# EAGLE design SC_UnoNeoClock V1.2 (EAGLE 8.7.0)
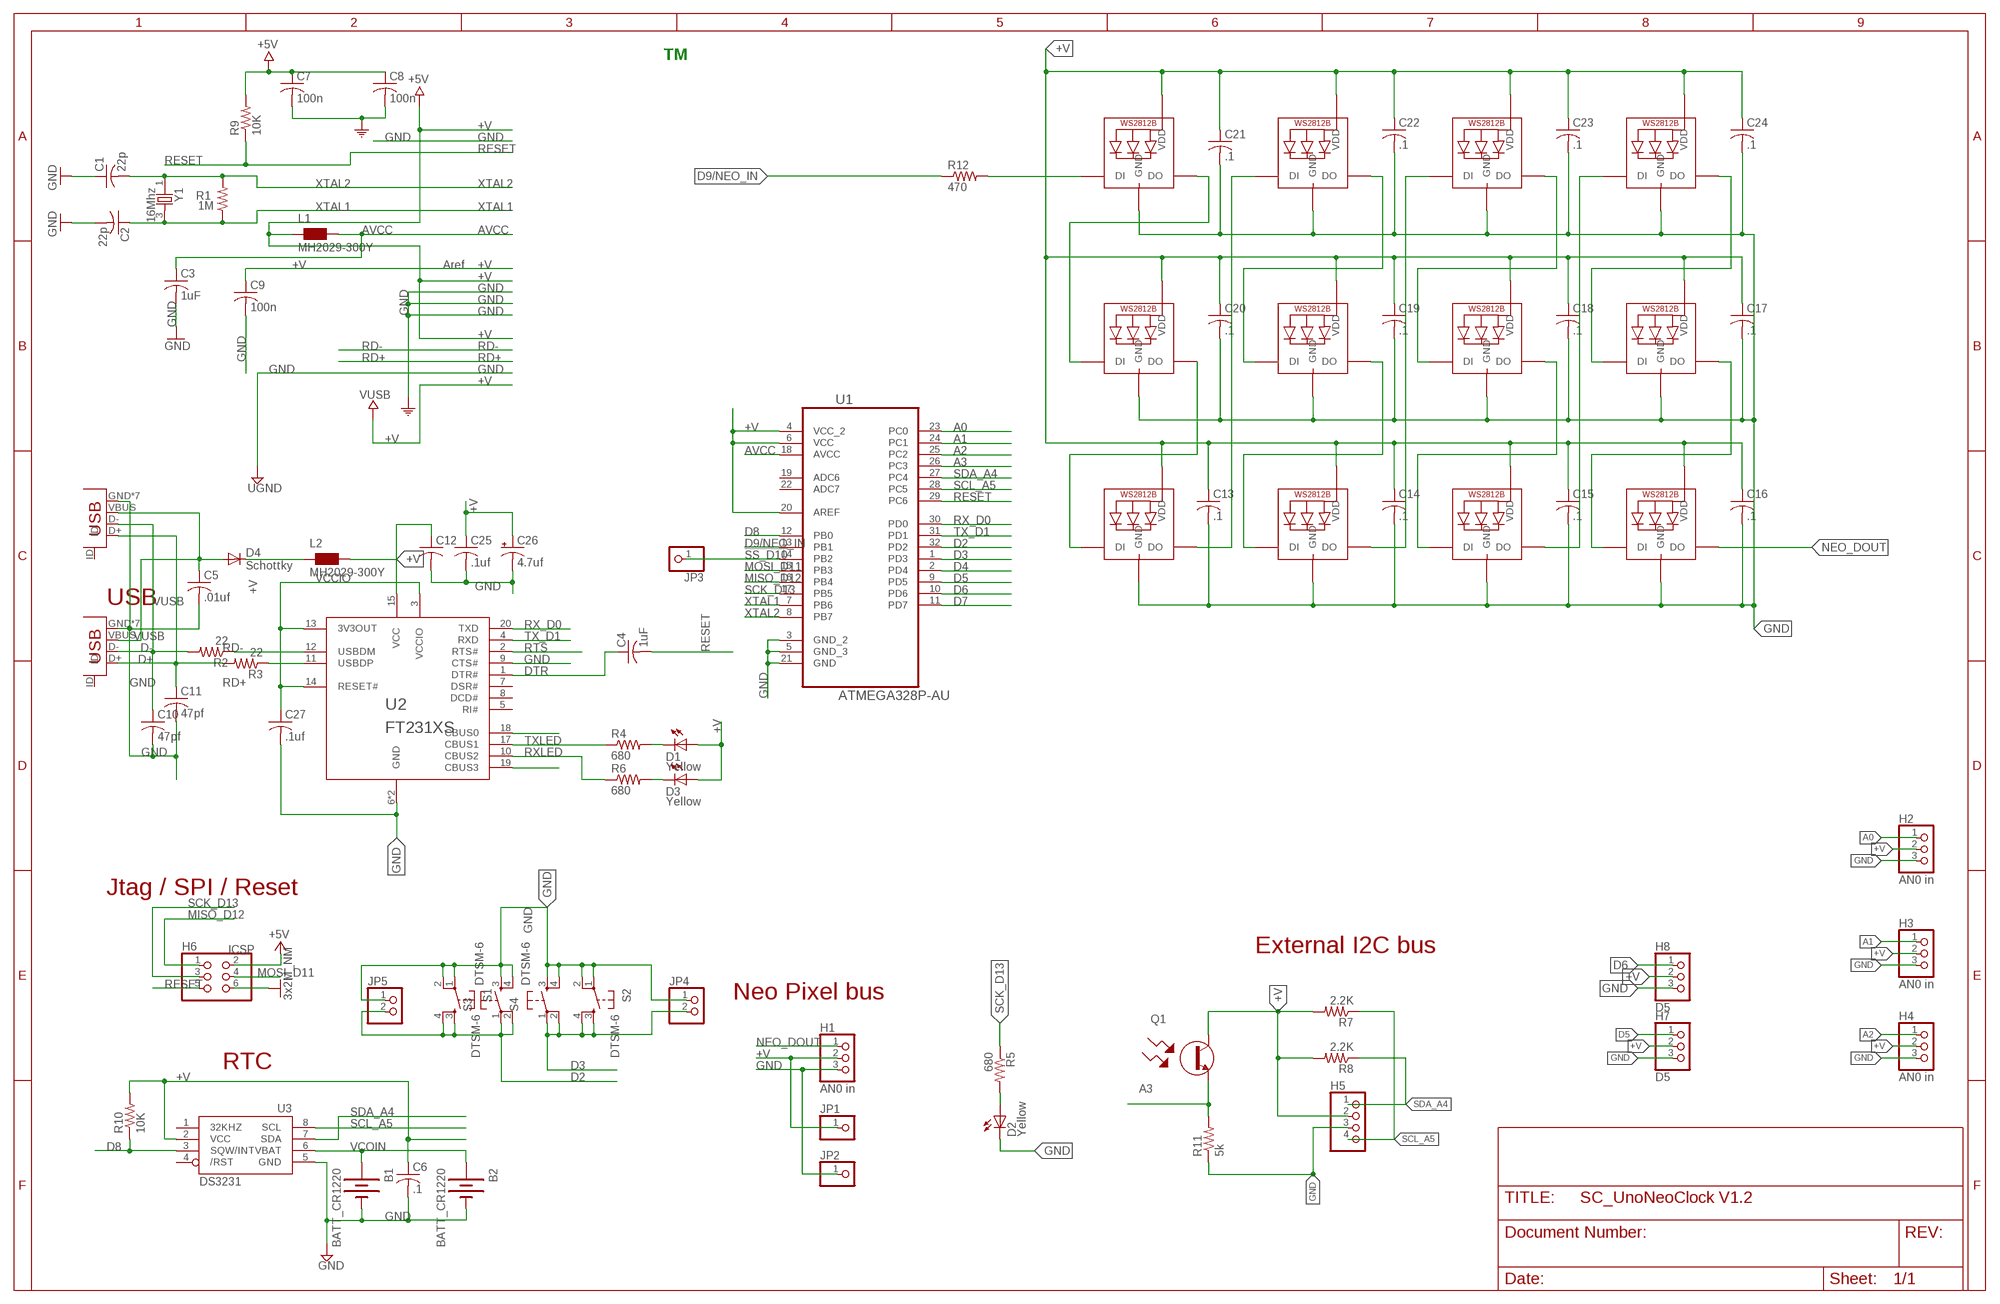
[diagram p0: schematic, sheet 1]

## Parts
B1  BATT_CR1220  [BATT_CR1220_HOLDER_SMT]
B2  BATT_CR1220  [BATT_CR1220_HOLDER_SMT]
C1  22p  C-USC0805K  [C0805K]
C2  22p  C-USC0805K  [C0805K]
C3  1uF  C-USC0805K  [C0805K]
C4  1uF  C-USC0805K  [C0805K]
C5  .01uf  C-USC0805K  [C0805K]
C6  .1  C-USC0805K  [C0805K]
C7  100n  C-USC0805K  [C0805K]
C8  100n  C-USC0805K  [C0805K]
C9  100n  C-USC0805K  [C0805K]
C10  47pf  C-USC0805K  [C0805K]
C11  47pf  C-USC0805K  [C0805K]
C12  C-USC1206K  [C1206K]
C13  .1  C-USC0805K  [C0805K]
C14  .1  C-USC0805K  [C0805K]
C15  .1  C-USC0805K  [C0805K]
C16  .1  C-USC0805K  [C0805K]
C17  .1  C-USC0805K  [C0805K]
C18  .1  C-USC0805K  [C0805K]
C19  .1  C-USC0805K  [C0805K]
C20  .1  C-USC0805K  [C0805K]
C21  .1  C-USC0805K  [C0805K]
C22  .1  C-USC0805K  [C0805K]
C23  .1  C-USC0805K  [C0805K]
C24  .1  C-USC0805K  [C0805K]
C25  .1uf  C-USC0805K  [C0805K]
C26  4.7uf  CPOL-USSMCP  [SMC_P]
C27  .1uf  C-USC0805K  [C0805K]
D1  Yellow  LEDCHIP-LED0805  [CHIP-LED0805]
D2  Yellow  LEDCHIP-LED0805  [CHIP-LED0805]
D3  Yellow  LEDCHIP-LED0805  [CHIP-LED0805]
D4  Schottky  DIODE-SOD123  [SOD123]
H1  AN0 in  PINHD-1X03_2.54-S  [1X03-S]
H2  AN0 in  PINHD-1X03_2.54-S  [1X03-S]
H3  AN0 in  PINHD-1X03_2.54-S  [1X03-S]
H4  AN0 in  PINHD-1X03_2.54-S  [1X03-S]
H5  PINHD-1X04_2.54-S  [1X04-S]
H6  ICSP  PINHD-2X3  [2X03]
H7  D5  PINHD-1X03_2.54-S  [1X03-S]
H8  D5  PINHD-1X03_2.54-S  [1X03-S]
J1  USB-MICRO-B-SMT/TH  [USB-MICRO-B-SMT]
J2  USB-MICRO-B-SMT/TH  [USB-MICRO-B-SMT]
JP1  PINHD-1X1  [1X01]
JP2  PINHD-1X1  [1X01]
JP3  PINHD-1X1  [1X01]
JP4  PINHD-1X02_2.54-S  [1X02-S]
JP5  PINHD-1X02_2.54-S  [1X02-S]
L1  MH2029-300Y  WE-CBF_0805  [0805]
L2  MH2029-300Y  WE-CBF_0805  [0805]
LED1  WS2812B5050  [WS2812B]
LED2  WS2812B5050  [WS2812B]
LED3  WS2812B5050  [WS2812B]
LED4  WS2812B5050  [WS2812B]
LED5  WS2812B5050  [WS2812B]
LED6  WS2812B5050  [WS2812B]
LED7  WS2812B5050  [WS2812B]
LED8  WS2812B5050  [WS2812B]
LED9  WS2812B5050  [WS2812B]
LED10  WS2812B5050  [WS2812B]
LED11  WS2812B5050  [WS2812B]
LED12  WS2812B5050  [WS2812B]
Q1  KDT00030FSTR  [PT0603]
R1  1M  R-US_R0805  [R0805]
R2  22  R-US_R0805  [R0805]
R3  22  R-US_R0805  [R0805]
R4  680  R-US_R0805  [R0805]
R5  680  R-US_R0805  [R0805]
R6  680  R-US_R0805  [R0805]
R7  2.2K  R-US_R0805  [R0805]
R8  2.2K  R-US_R0805  [R0805]
R9  10K  R-US_R0805  [R0805]
R10  10K  R-US_R0805  [R0805]
R11  5k  R-US_R0805  [R0805]
R12  470  R-US_R0805  [R0805]
S1  DTSM-6  [DTSM-6]
S2  DTSM-6  [DTSM-6]
S3  DTSM-6  [DTSM-6]
S4  DTSM-6  [DTSM-6]
U1  ATMEGA328P-AU  [QFP80P900X900X120-32N]
U2  FT231XS  [SSOP20]
U3  DS3231  [SOIC8]
Y1  16Mhz  XTAL3X5MM  [3X5XTAL-SMT]

## Nets
!SS_D10: JP3.1 U1.14(PB2)
+V [usbvcc]: C6.1 C7.1 C8.1 C9.1 C12.1 C13.1 C14.1 C15.1 C16.1 C17.1 C18.1 C19.1 C20.1 C21.1 C22.1 C23.1 C24.1 C25.1 C26.+ D1.A D3.A H1.2 H2.2 H3.2 H4.2 H5.2 H6.2 H7.2 H8.2 JP1.1 L1.1 L2.2 LED1.1-VDD(VDD) LED2.1-VDD(VDD) LED3.1-VDD(VDD) LED4.1-VDD(VDD) LED5.1-VDD(VDD) LED6.1-VDD(VDD) LED7.1-VDD(VDD) LED8.1-VDD(VDD) LED9.1-VDD(VDD) LED10.1-VDD(VDD) LED11.1-VDD(VDD) LED12.1-VDD(VDD) Q1.C R7.2 R8.2 R9.2 R10.2 U1.4(VCC_2) U1.6(VCC) U1.20(AREF) U2.15(VCC) U3.2(VCC) ; supply symbol labelled +5V, VUSB
A0: H2.1 U1.23(PC0)
A1: H3.1 U1.24(PC1)
A2: H4.1 U1.25(PC2)
A3: Q1.E R11.2 U1.26(PC3)
AVCC: C3.1 L1.2 U1.18(AVCC)
D2: JP5.2 S1.3 S1.4 S3.1 S3.2 U1.32(PD2)
D3: JP4.2 S2.3 S2.4 S4.1 S4.2 U1.1(PD3)
D4: U1.2(PD4)
D5: H7.1 U1.9(PD5)
D6: H8.1 U1.10(PD6)
D7: U1.11(PD7)
D8: R10.1 U1.12(PB0) U3.3(SQW/INT)
D9/NEO_IN: R12.1 U1.13(PB1)
D+: C11.1 J1.D+ J2.D+ R3.2
D-: C10.1 J1.D- J2.D- R2.2
DTR: C4.1 U2.1(DTR#)
GND [gnd]: B1.1(-) B2.1(-) C1.1 C2.2 C3.2 C5.2 C6.2 C7.2 C8.2 C9.2 C10.2 C11.2 C12.2 C13.2 C14.2 C15.2 C16.2 C17.2 C18.2 C19.2 C20.2 C21.2 C22.2 C23.2 C24.2 C25.2 C26.- C27.2 D2.C H1.3 H2.3 H3.3 H4.3 H5.3 H6.6 H7.3 H8.3 J1.GND J1.GND@1(GND) J1.GND@2(GND) J1.GND@3(GND) J1.GND@4(GND) J1.GND@5(GND) J1.GND@6(GND) J2.GND J2.GND@1(GND) J2.GND@2(GND) J2.GND@3(GND) J2.GND@4(GND) J2.GND@5(GND) J2.GND@6(GND) JP2.1 JP4.1 JP5.1 LED1.3-GND(GND) LED2.3-GND(GND) LED3.3-GND(GND) LED4.3-GND(GND) LED5.3-GND(GND) LED6.3-GND(GND) LED7.3-GND(GND) LED8.3-GND(GND) LED9.3-GND(GND) LED10.3-GND(GND) LED11.3-GND(GND) LED12.3-GND(GND) R11.1 S1.1 S1.2 S2.1 S2.2 S3.3 S3.4 S4.3 S4.4 U1.3(GND_2) U1.5(GND_3) U1.21(GND) U2.6(GND) U2.9(CTS#) U2.16(GND) U3.5(GND) ; supply symbol labelled 3x2M_NM, COM, UGND
MISO_D12: H6.1 U1.16(PB4)
MOSI_D11: H6.4 U1.15(PB3)
N$1: D2.A R5.2
N$2: D3.C R6.2
N$3: D1.C R4.2
N$4: LED1.2-DOUT(DO) LED2.4-DIN(DI)
N$5 [usbvcc]: D4.C L2.1
N$6: LED2.2-DOUT(DO) LED3.4-DIN(DI)
N$7: U2.18(CBUS0)
N$8: U2.19(CBUS3)
N$9: LED3.2-DOUT(DO) LED4.4-DIN(DI)
N$10: LED4.2-DOUT(DO) LED5.4-DIN(DI)
N$11: LED5.2-DOUT(DO) LED6.4-DIN(DI)
N$12: LED6.2-DOUT(DO) LED7.4-DIN(DI)
N$13: LED7.2-DOUT(DO) LED8.4-DIN(DI)
N$14: LED8.2-DOUT(DO) LED9.4-DIN(DI)
N$15: LED9.2-DOUT(DO) LED10.4-DIN(DI)
N$16: LED10.2-DOUT(DO) LED11.4-DIN(DI)
N$17: LED11.2-DOUT(DO) LED12.4-DIN(DI)
N$18: LED1.4-DIN(DI) R12.2
NEO_DOUT: H1.1 LED12.2-DOUT(DO)
RD+: R3.1 U2.11(USBDP)
RD-: R2.1 U2.12(USBDM)
RESET: C4.2 H6.5 R9.1 U1.29(PC6)
RTS: U2.2(RTS#)
RX_D0: U1.30(PD0) U2.20(TXD)
RXLED: R6.1 U2.10(CBUS2)
SCK_D13: H6.3 R5.1 U1.17(PB5)
SCL_A5: H5.4 R7.1 U1.28(PC5) U3.8(SCL)
SDA_A4: H5.1 R8.1 U1.27(PC4) U3.7(SDA)
TX_D1: U1.31(PD1) U2.4(RXD)
TXLED: R4.1 U2.17(CBUS1)
VCCIO: C27.1 U2.3(VCCIO) U2.13(3V3OUT) U2.14(RESET#)
VCOIN: B1.3(+) B2.3(+) U3.6(VBAT)
VUSB [usbvcc]: C5.1 D4.A J1.VBUS J2.VBUS
XTAL1: C2.1 R1.1 U1.7(PB6) Y1.3
XTAL2: C1.2 R1.2 U1.8(PB7) Y1.1
Unconnected: J1.ID J2.ID U1.19(ADC6) U1.22(ADC7) U2.5(RI#) U2.7(DSR#) U2.8(DCD#) U3.1(32KHZ) U3.4(/RST)

## Notes on the sheet
- TM
- Aref
- USB
- Jtag / SPI / Reset
- External I2C bus
- Neo Pixel bus
- RTC

## Library data of the parts
B1 B2 = dfb-parts:BATT_CR1220
C1-C25 C27 = rcl:C-US: CAPACITOR, American symbol
C26 = rcl:CPOL-US: POLARIZED CAPACITOR, American symbol
D1-D3 = Leoled:LED: LED OSRAM: - CHIPLED LG R971, LG N971, LY N971, LG Q971, LY Q971, LO R971, LY R971 LH N974, LH R974 LS Q976, LO Q976, LY Q976 LO Q996 - Hyper CHIPLED LW Q18S LB Q993, LB Q99A, LB R99A - SideLED LS A670, LO A670, LY A670, LG A670, LP A670 LB A673, LV A673, LT A673, LW A673 LH A674 LY A675 LS A676, LA A676, LO A676, LY A676, LW A676 LS A679, LY A679, LG A679 - Hyper Micro SIDELED® LS Y876, LA Y876, LO Y876, LY Y876 LT Y87S - SmartLED LW L88C, LW L88S LB L89C, LB L89S, LG L890 LS L89K, LO L89K, LY L89K LS L896, LA L896, LO L896, LY L896 - TOPLED LS T670, LO T670, LY T670, LG T670, LP T670 LSG T670, LSP T670, LSY T670, LOP T670, LYG T670 LG T671, LOG T671, LSG T671 LB T673, LV T673, LT T673, LW T673 LH T674 LS T676, LA T676, LO T676, LY T676, LB T676, LH T676, LSB T676, LW T676 LB T67C, LV T67C, LT T67C, LS T67K, LO T67K, LY T67K, LW E67C LS E67B, LA E67B, LO E67B, LY E67B, LB E67C, LV E67C, LT E67C LW T67C LS T679, LY T679, LG T679 LS T770, LO T770, LY T770, LG T770, LP T770 LB T773, LV T773, LT T773, LW T773 LH T774 LS E675, LA E675, LY E675, LS T675 LS T776, LA T776, LO T776, LY T776, LB T776 LHGB T686 LT T68C, LB T68C - Hyper Mini TOPLED® LB M676 - Mini TOPLED Santana® LG M470 LS M47K, LO M47K, LY M47K Source: http://www.osram.convergy.de LUXEON: - LUMILED® LXK2-PW12-R00, LXK2-PW12-S00, LXK2-PW14-U00, LXK2-PW14-V00 LXK2-PM12-R00, LXK2-PM12-S00, LXK2-PM14-U00 LXK2-PE12-Q00, LXK2-PE12-R00, LXK2-PE12-S00, LXK2-PE14-T00, LXK2-PE14-U00 LXK2-PB12-K00, LXK2-PB12-L00, LXK2-PB12-M00, LXK2-PB14-N00, LXK2-PB14-P00, LXK2-PB14-Q00 LXK2-PR12-L00, LXK2-PR12-M00, LXK2-PR14-Q00, LXK2-PR14-R00 LXK2-PD12-Q00, LXK2-PD12-R00, LXK2-PD12-S00 LXK2-PH12-R00, LXK2-PH12-S00 LXK2-PL12-P00, LXK2-PL12-Q00, LXK2-PL12-R00 Source: www.luxeon.com KINGBRIGHT: KA-3528ASYC Source: www.kingbright.com
D4 = diode:DIODE-: DIODE
H1-H4 H7 H8 = pinhead-2:PINHD-1X03: PIN HEADER
H5 = pinhead-2:PINHD-1X04: PIN HEADER
H6 = SmartPrj:PINHD-2X3: PIN HEADER
J1 J2 = dfb-parts:USB-MICRO-B-SMT/TH
JP1-JP3 = pinhead:PINHD-1X1: PIN HEADER
JP4 JP5 = pinhead-2:PINHD-1X02: PIN HEADER
L1 L2 = wuerth-elektronik:WE-CBF: SMD EMI Suppression Ferrite Beads - excellent anti-EMI properties - low DCR - impedances till 3000 ohms - rated current up to 6 A
LED1-LED12 = adafruit:WS2812B
Q1 = dfb-parts:KDT00030
R1-R12 = rcl:R-US_: RESISTOR, American symbol
S1-S4 = switch-tact:DTSM-6
U1 = ATMEGA328P-AU:ATMEGA328P-AU: 8-bit Microcontroller with In-System Programmable Flash
U2 = FT231XS:FT231XS
U3 = dfb-parts:DS3231
Y1 = dfb-parts:XTAL3X5MM

## Net classes
0 default: width 0.254 mm, drill 0.61 mm, clearance 0.254 mm
1 power: width 0.254 mm, drill 0.61 mm, clearance 0.254 mm
2 gnd: width 0.254 mm, drill 0.61 mm, clearance 0.254 mm
3 usbvcc: width 0.254 mm, drill 0.61 mm, clearance 0.254 mm
4 aref: width 0.254 mm, drill 0.61 mm, clearance 0.254 mm

## Board
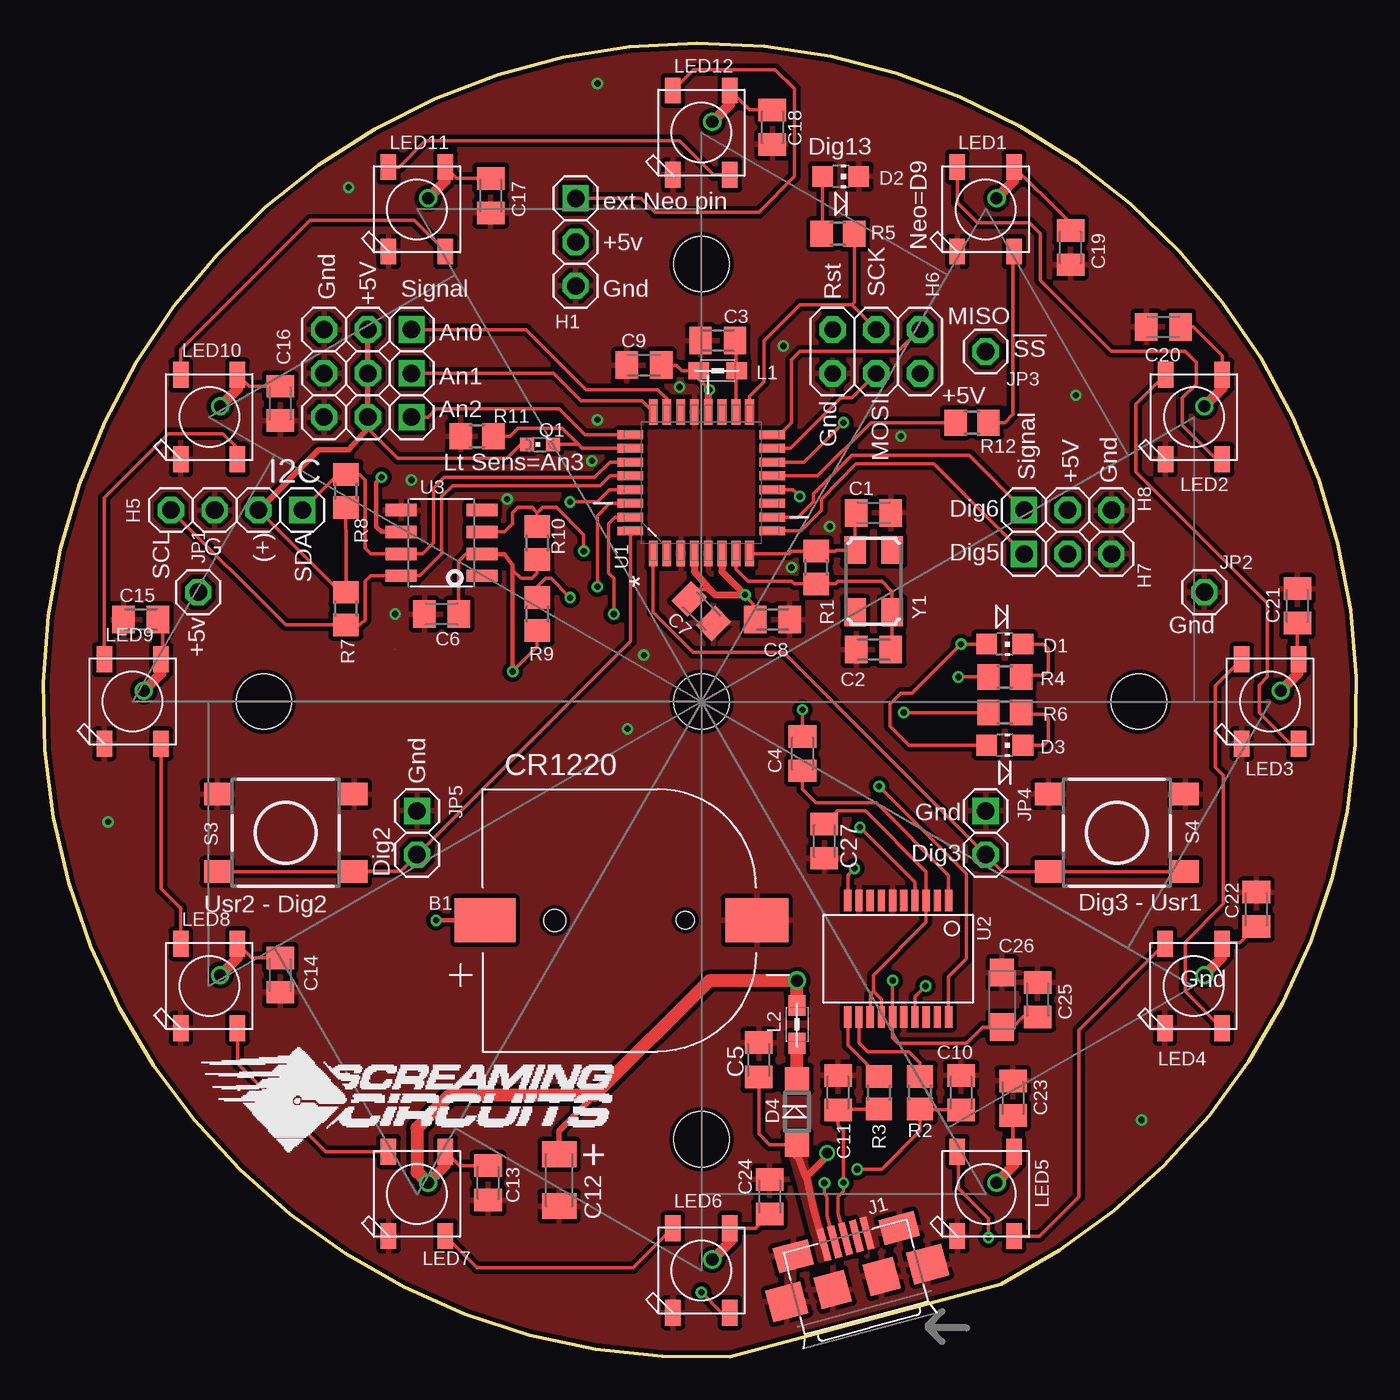
[diagram p1: board, top side]
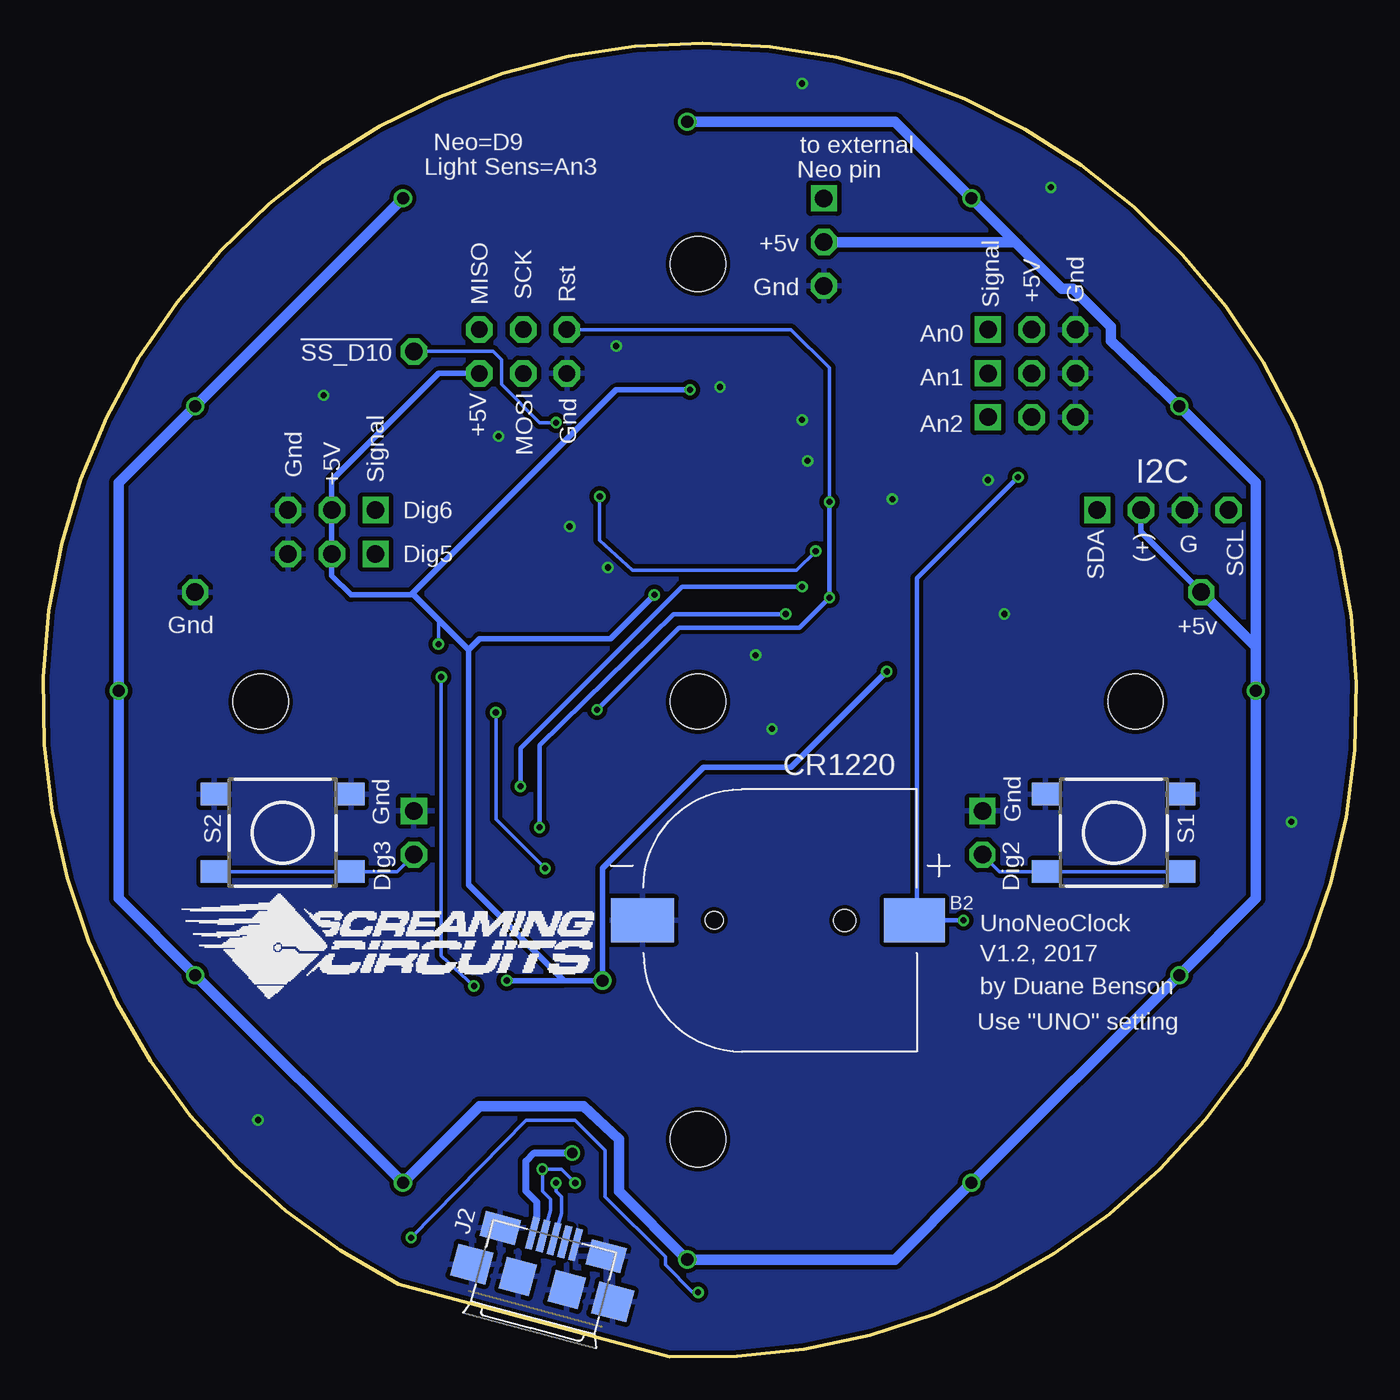
[diagram p2: board, bottom side, seen from below]

Size 76.26 x 76.26 mm. Coordinates in mm from the lower left corner, seen from the top.
Outline: 39.87,0 55.62,4.2 arc335 39.87,0
Copper layers (1*16): Top 0.035mm / dielectric 1.5mm / Bottom 0.035mm
Design rules "ITEADstudio_DRC": minimum track width 6mil, minimum drill 12mil, track to track 6mil, track to pad 6mil, pad to pad 6mil, via to via 6mil, smd to smd 0mil, copper to edge 10mil, drill to drill 10mil, minimum pad ring 10mil, minimum via ring 6mil, stop-mask expansion 2mil, vias tented up to drill 100mil, thermal gap 10mil
Holes 3.2 mm at 38.22,38.04 38.22,63.44 12.82,38.04 38.22,12.64 63.62,38.04
vRestrict: area 48,10.2 to 48.6,10.7; area 50.5,10.1 to 51,11

### Footprints (pad centres in the part's own frame; a part is rotated, then mirrored left to right if it is on the bottom)
BATT_CR1220_HOLDER_SMT = smd 3.658 x 2.54: 1 -7.671,0 | smd 3.531 x 2.54: 3 8.115,0 | hole 1.016: -3.505,0 | hole 1.27: 4.064,0
C0805K = smd 1.3 x 1.6: 1 -1,0; 2 1,0
C1206K = smd 1.5 x 2: 1 -1.5,0; 2 1.5,0
SMC_P = smd 1.6 x 1.4: + -1.575,0; - 1.575,0
CHIP-LED0805 = smd 1.2 x 1.2: A 0,-1.05; C 0,1.05
SOD123 = smd 1.4 x 1.4: A 1.9,0; C -1.9,0
1X03-S = drill 1.016 square: 1 -2.54,0 | drill 1.016 octagon: 2 0,0; 3 2.54,0
1X04-S = drill 1.016 square: 1 -3.81,0 | drill 1.016 octagon: 2 -1.27,0; 3 1.27,0; 4 3.81,0
2X03 = drill 0.95 pad 1.55 octagon: 1 -2.54,-1.27; 2 -2.54,1.27; 3 0,-1.27; 4 0,1.27; 5 2.54,-1.27; 6 2.54,1.27
USB-MICRO-B-SMT = smd 0.4 x 1.9: D+ 0,2.75; D- -0.65,2.75; GND 1.3,2.75; ID 0.65,2.75; VBUS -1.3,2.75 | smd 2.1 x 1.5: GND@1 -3.183,2.558; GND@6 3.183,2.558 | smd 2.1 x 1.9: GND@2 -4.235,0.1; GND@3 4.235,0.1 | smd 1.8 x 1.9: GND@4 -1.468,0.1; GND@5 1.468,0.1
1X01 = drill 1.016 octagon: 1 0,0
1X02-S = drill 1.016 square: 1 -1.27,0 | drill 1.016 octagon: 2 1.27,0
0805 = smd 1.2 x 1: 1 -1.1,0; 2 1.1,0
WS2812B = smd 1.5 x 0.9: 1-VDD 2.45,-1.65; 2-DOUT 2.45,1.65; 3-GND -2.45,1.65; 4-DIN -2.45,-1.65
PT0603 = smd 0.8 x 0.8: C -0.75,0; E 0.75,0
R0805 = smd 1.3 x 1.5: 1 -0.95,0; 2 0.95,0
DTSM-6 = smd 1.55 x 1.3: 1 -3.975,2.25; 2 3.975,2.25; 3 -3.975,-2.25; 4 3.975,-2.25
QFP80P900X900X120-32N = smd 1.473 x 0.508: 1 -4.115,2.794; 2 -4.115,2.007; 3 -4.115,1.194; 4 -4.115,0.406; 5 -4.115,-0.406; 6 -4.115,-1.194; 7 -4.115,-2.007; 8 -4.115,-2.794; 17 4.115,-2.794; 18 4.115,-2.007; 19 4.115,-1.194; 20 4.115,-0.406; 21 4.115,0.406; 22 4.115,1.194; 23 4.115,2.007; 24 4.115,2.794 | smd 0.508 x 1.473: 9 -2.794,-4.115; 10 -2.007,-4.115; 11 -1.194,-4.115; 12 -0.406,-4.115; 13 0.406,-4.115; 14 1.194,-4.115; 15 2.007,-4.115; 16 2.794,-4.115; 25 2.794,4.115; 26 2.007,4.115; 27 1.194,4.115; 28 0.406,4.115; 29 -0.406,4.115; 30 -1.194,4.115; 31 -2.007,4.115; 32 -2.794,4.115
SSOP20 = smd 0.42 x 1.25: 1 -2.925,-3.375; 2 -2.275,-3.375; 3 -1.625,-3.375; 4 -0.975,-3.375; 5 -0.325,-3.375; 6 0.325,-3.375; 7 0.975,-3.375; 8 1.625,-3.375; 9 2.275,-3.375; 10 2.925,-3.375; 11 2.925,3.375; 12 2.275,3.375; 13 1.625,3.375; 14 0.975,3.375; 15 0.325,3.375; 16 -0.325,3.375; 17 -0.975,3.375; 18 -1.625,3.375; 19 -2.275,3.375; 20 -2.925,3.375
SOIC8 = smd 1.778 x 0.711: 1 -2.349,1.905; 2 -2.349,0.635; 3 -2.349,-0.635; 4 -2.349,-1.905; 5 2.349,-1.905; 6 2.349,-0.635; 7 2.349,0.635; 8 2.349,1.905
3X5XTAL-SMT = smd 1.6 x 1.25: 1 -1.8,-1.075; 2 1.8,-1.075; 3 1.8,1.075; 4 -1.8,1.075

### Placement (x,y rotation side)
B1  33.78,25.34 180 top
B2  33.78,25.34 0 bottom
C1  48.22,48.99 180 top
C2  48.22,41.05 180 top
C3  39.18,58.99 180 top
C4  44.1,35.02 90 top
C5  41.56,17.24 90 top
C6  23.14,43.12 180 top
C7  38.22,43.28 315 top
C8  42.35,42.8 0 top
C9  34.89,57.56 180 top
C10  53.3,15.34 90 top
C11  46.16,15.34 90 top
C12  29.97,10.26 270 top
C13  25.84,10.1 270 top
C14  13.78,22.16 270 top
C15  5.68,42.8 180 top
C16  13.78,55.34 270 top
C17  26,67.41 270 top
C18  42.35,71.37 270 top
C19  59.65,64.39 270 top
C20  65.05,59.79 180 top
C21  72.83,43.59 90 top
C22  70.45,25.97 90 top
C23  56.32,15.02 90 top
C24  42.19,9.3 90 top
C25  57.75,20.73 90 top
C26  55.69,20.73 90 top
C27  45.37,29.94 270 top
D1  55.84,41.37 270 top
D2  46.32,68.52 270 top
D3  55.84,35.5 270 top
D4  43.78,14.22 270 top
H1  30.92,64.71 270 top
H2  18.86,59.63 180 top
H3  18.86,57.09 180 top
H4  18.86,54.55 180 top
H5  11.24,49.15 180 top
H6  48.38,58.36 180 top
H7  59.5,46.61 0 top
H8  59.5,49.15 0 top
J1  47.3,4.19 15 top
J2  47.3,4.19 345 bottom
JP1  9.01,44.39 270 top
JP2  67.43,44.39 0 top
JP3  54.73,58.36 0 top
JP4  54.73,30.42 270 top
JP5  21.71,30.42 270 top
L1  39.18,57.25 0 top
L2  43.78,19.3 90 top
LED1  54.73,66.61 90 top
LED2  66.82,54.55 90 top
LED3  71.24,38.04 90 top
LED4  66.8,21.53 90 top
LED5  54.73,9.46 90 top
LED6  38.22,5.02 90 top
LED7  21.71,9.46 90 top
LED8  9.65,21.53 90 top
LED9  5.2,38.04 90 top
LED10  9.65,54.55 90 top
LED11  21.71,66.61 90 top
LED12  38.22,71.06 90 top
Q1  28.86,52.96 0 top
R1  44.89,45.82 90 top
R2  50.92,15.34 270 top
R3  48.54,15.34 270 top
R4  55.84,39.47 0 top
R5  46.16,65.18 180 top
R6  55.84,37.4 0 top
R7  17.59,43.43 90 top
R8  17.59,50.26 270 top
R9  28.7,43.12 270 top
R10  28.7,47.24 270 top
R11  25.21,53.44 0 top
R12  53.94,54.23 0 top
S1  14.09,30.42 0 bottom
S2  62.35,30.42 0 bottom
S3  14.09,30.42 180 top
S4  62.35,30.42 180 top
U1  38.22,50.74 90 top
U2  49.65,23.11 180 top
U3  23.14,47.24 180 top
U$1  [CLOCKPOSITION]  38.22,38.04 0 top
U$2  [CLOCKPOSITION]  38.22,38.04 30 top
U$3  [SC-LOGO]  22.51,14.38 0 top
U$4  [CLOCKPOSITION]  38.22,38.04 60 top
U$5  [CLOCKPOSITION]  38.22,38.04 150 top
U$6  [CLOCKPOSITION]  38.22,38.04 120 top
U$7  [CLOCKPOSITION]  38.22,38.04 90 top
U$8  [CLOCKPOSITION]  38.22,38.04 330 top
U$9  [CLOCKPOSITION]  38.22,38.04 300 top
U$10  [CLOCKPOSITION]  38.22,38.04 270 top
U$11  [CLOCKPOSITION]  38.22,38.04 180 top
U$12  [CLOCKPOSITION]  38.22,38.04 210 top
U$13  [CLOCKPOSITION]  38.22,38.04 240 top
U$14  [SC-LOGO]  54.89,23.27 0 bottom
Y1  48.22,45.02 270 top

### Tracks (layer width: path | path; a pad name or v marks a point on that pad's centre or on a via)
!SS_D10  (via drill 0.36)
  Top 0.203: U1.14 44.18,51.93 v46.48,54.23
  Bottom 0.203: v46.48,54.23 47.43,54.23 49.65,56.45 49.65,57.88 50.13,58.36 JP3.1
+V  (via drill 0.36, 0.7)
  Top 0.203: 25.51,46.59 U3.2 24.57,46.61 24.14,46.18 C6.1 23.74,42.76 | 18.86,53.91 20.6,52.17 26.95,52.17 27.74,52.96 Q1.C | R8.2 17.58,48.2 17.58,47.88 R7.2 17.27,44.38 H5.2 | 26.81,46.61 26.79,46.59 | R9.2 28.7,41.21 v27.27,39.78 | v49.33,21.84 U2.15 49.33,18.52 49.65,18.19 53.62,18.19 54.57,19.15 55.67,19.15 C26.+ 56.33,19.16 56.91,19.73 C25.1 | D3.A 50.29,35.5 49.18,36.61 49.18,37.88 49.81,38.51 50.45,38.51 v53.3,41.37 D1.A | v38.7,56.13 38.08,56.76 L1.1 37.11,57.25 36.79,57.56 C9.1 | C7.1 38.06,44.55 38.86,44.55 38.78,44.47 | C8.1 41.35,43.55 v40.76,44.23 | C23.1 56.33,11.81 LED5.1-VDD | C22.1 69.5,24.03 68.54,24.07 LED4.1-VDD | C21.1 72.84,40.7 LED3.1-VDD | C19.1 59.65,65.82 58.1,67.37 57.6,67.85 LED1.1-VDD | C15.1 6.63,42.64 6.96,42.32 6.96,41.02 LED9.1-VDD | LED2.1-VDD 68.47,58.11 66.8,59.79 C20.1 | LED6.1-VDD 41.36,7.47 C24.1 | C17.1 24.02,68.41 LED11.1-VDD | C18.1 41.01,72.37 LED12.1-VDD | C13.1 24.18,11.1 LED7.1-VDD | C14.1 12.11,23.16 LED8.1-VDD | C16.1 11.95,56.34 LED10.1-VDD | R10.2 28.7,45.5 28.38,45.18 27.74,45.18 27.27,45.66
  Top 0.254: 25.51,46.59 26.79,46.59 27.27,45.96 27.27,45.66 v27.27,39.78
  Top 0.305: H2.2 H3.2 H4.2 18.86,53.91 17.74,52.64 16,52.64 H5.2 | C12.1 29.97,13.11 32.03,15.18
  Top 0.406: U1.20 38.63,56.06 v38.7,56.13 | U1.4 37.82,45.59 38.78,44.47 39.02,44.23 v40.76,44.23 39.42,45.57 U1.6 | LED6.1-VDD 40.03,6.83
  Top 0.61: v55.37,67.25 56.38,68.26 LED1.1-VDD | v67.43,55.18 68.47,56.22 LED2.1-VDD | v71.88,38.67 72.89,39.69 LED3.1-VDD | v67.43,22.16 68.45,23.18 LED4.1-VDD | v55.37,10.1 56.38,11.11 LED5.1-VDD | 40.03,6.83 v38.86,5.65 | v22.35,10.1 23.36,11.11 LED7.1-VDD | v10.28,22.16 11.3,23.18 LED8.1-VDD | v5.84,38.67 6.85,39.69 LED9.1-VDD | v22.35,67.25 23.36,68.26 LED11.1-VDD | v38.86,71.69 39.87,72.71 LED12.1-VDD | LED10.1-VDD 11.34,57 11.34,56.24 v10.28,55.18
  Top 0.762: L2.2 v43.78,21.84 38.7,21.84 32.03,15.18 23.62,15.18 21.71,13.27 21.71,10.73 v22.35,10.1
  Bottom 0.203: v53.3,41.37 53.3,42.8
  Bottom 0.305: 46,21.84 v43.78,21.84 43.78,28.35 37.9,34.23 32.83,34.23 v27.27,39.78 | v49.33,21.84 46,21.84 | 46,21.84 51.56,27.4 51.56,41.05 | 51.56,41.05 53.3,42.8 54.73,44.23 54.89,44.23 | 54.89,44.23 58.38,44.23 59.5,45.34 H7.2 H8.2 59.5,50.9 53.3,57.09 H6.2 | v38.7,56.13 42.98,56.13 54.89,44.23 | 51.56,41.05 50.92,41.69 43.3,41.69 v40.76,44.23 | H5.2 12.51,47.88 JP1.1
  Bottom 0.61: v55.37,67.25 v67.43,55.18 71.88,50.74 v71.88,38.67 71.88,26.61 v67.43,22.16 v55.37,10.1 50.92,14.54 44.89,14.54 42.83,12.64 42.83,9.62 v38.86,5.65 26.79,5.65 v22.35,10.1 v10.28,22.16 5.84,26.61 v5.84,38.67 5.84,41.21 | 5.84,41.21 5.84,50.74 v10.28,55.18 14.25,58.99 14.25,59.79 16.47,62.01 17.11,62.01 19.81,64.71 | 19.81,64.71 v22.35,67.25 26.79,71.69 v38.86,71.69 | H1.2 19.81,64.71 | JP1.1 5.84,41.21
A0
  Top 0.203: H2.1 28.05,59.63 31.54,56.13 35.68,56.13 36.22,55.6 U1.23
A1
  Top 0.203: H3.1 29.65,57.09 31.24,55.5 34.78,55.5 U1.24
A2
  Top 0.203: H4.1 22.35,54.55 22.82,55.02 29.97,55.02 31.46,53.53 U1.25
A3
  Top 0.203: 31.08,52.96 Q1.E | 31.08,52.96 30.13,53.91 27.59,53.91 27.13,53.45 R11.2 | U1.26 31.29,52.74 31.08,52.96
AVCC
  Top 0.203: U1.18 40.23,58.31 | 40.23,58.31 L1.2 | C3.1 40.18,58.36 40.23,58.31
D2
  Top 0.203: S1.4 S1.3 18.1,28.19 20.76,28.19 JP5.2 34.11,41.54 U1.32
  Bottom 0.203: S1.4 S1.3 20.73,28.17 JP5.2
D3
  Top 0.203: S2.3 S2.4 55.71,28.17 JP4.2 42.98,40.89 37.75,40.89 35.43,43.21 U1.1
  Bottom 0.203: S2.3 S2.4 55.71,28.17 JP4.2
D5
  Top 0.203: H7.1 51.72,51.85 47.21,51.85 45.21,49.78 45.21,49.15 44,47.94 U1.9
D6
  Top 0.203: H8.1 53.78,52.32 46.95,52.32 44.73,50.1 44.73,49.63 43.84,48.73 U1.10
D8  (via drill 0.36)
  Top 0.203: v31.4,46.77 31.4,47.72 29.81,49.31 29.01,49.31 28.7,48.99 | U3.3 26.79,47.88 27.27,48.36 27.27,48.99 27.59,49.31 28.38,49.31 28.7,48.99 | 28.7,48.99 R10.1 | U1.12 43.53,50.33 v43.94,49.94
  Bottom 0.203: v43.94,49.94 43.94,47.4 42.03,45.66 32.51,45.66 v31.4,46.77
D9/NEO_IN
  Top 0.203: U1.13 44.98,51.14 48.07,54.23 R12.1
D+  (via drill 0.36)
  Top 0.203: J2.D+ 46.16,8.35 46.16,9.3 46.48,9.62 v46.48,10.1 46.48,13.11 46.16,13.43 C11.1 46.21,14.39 R3.2
  Bottom 0.203: v46.48,10.1 46.48,9.62 46.16,9.3 46.16,8.35 J2.D+
D-  (via drill 0.38)
  Top 0.203: v45.37,10.1 45.37,9.46 45.53,9.3 45.53,8.19 J1.D- | v47.27,10.89 48.7,10.89 50.92,13.11 R2.2 50.97,14.34 C10.1
  Bottom 0.203: v45.37,10.1 46.16,10.89 v47.27,10.89 47.27,9.62 46.79,9.14 46.79,8.51 J2.D-
DTR
  Top 0.203: U2.1 52.58,27.97 48.38,32.16 44.89,32.16 44.1,32.96 C4.1
GND  (via drill 0.36)
  other vias: 20.44,43.12 26.95,49.78 21.4,50.9 31.87,52.01 34.89,40.74 33.94,36.45 42.99,58.67 32.19,54.39 43.46,45.82 59.97,55.82 49.81,53.44 45.68,48.2 36.95,56.29 63.78,13.75 3.77,31.05 32.19,73.91 17.74,67.88
  pour Bottom: 0.12,-0.06 0.12,76.14 76.32,76.14 76.32,-0.06
  pour Top (isolate 0.254, rank 2): 76.32,76.14 76.32,-0.06 0.12,-0.06 0.12,76.14
  pour Top (no thermals): 48.07,6.29 48.54,6.45 47.91,8.99 47.27,8.67 47.91,6.29
MISO_D12
  Top 0.203: H6.1 49.65,58.36 43.94,58.36 43.46,57.88 43.46,54.23 42.76,53.53 U1.16
MOSI_D11
  Top 0.203: H6.4 46.95,55.66 46.32,55.66 43.4,52.74 U1.15
N$1
  Top 0.203: D2.A 45.27,65.56 45.05,65.34 R5.2
N$2
  Top 0.203: D3.C 57.93,35.5 arc90 58.38,35.95 58.38,36.92 arc90 58,37.3 56.89,37.3 R6.2
N$3
  Top 0.203: D1.C 57.93,41.37 arc-90 58.38,40.92 58.38,39.95 arc-90 58,39.57 56.89,39.57 R4.2
N$4
  Top 0.203: LED2.4-DIN 68.14,52.1 66.16,54.07 66.16,55.66 66.96,56.45 66.96,57.72 66.32,58.36 62.04,58.36 57.91,62.48 57.91,65.18 57.27,65.82 54.26,65.82 53.08,66.99 LED1.2-DOUT
N$5
  Top 0.762: D4.C L2.1
N$6
  Top 0.203: LED3.4-DIN 72.42,35.59 70.61,37.4 70.61,38.99 71.08,39.47 71.08,43.75 63.46,51.37 63.46,55.29 LED2.2-DOUT
N$9
  Top 0.203: LED4.4-DIN 66.32,21.21 66.32,24.07 68.54,26.29 68.54,33.75 68.07,34.23 68.07,38.96 LED3.2-DOUT
N$10
  Top 0.203: LED5.4-DIN 57.84,7.01 60.13,9.3 60.13,18.96 LED4.2-DOUT
N$11  (via drill 0.36)
  Top 0.203: LED6.4-DIN 39.4,2.57 v38.22,3.75 | v54.89,6.92 54.89,8.03 53.15,9.78 53.15,11.85 LED5.2-DOUT
  Bottom 0.203: v38.22,3.75 38.54,3.75 40.13,5.33 40.13,5.81 43.62,9.3 43.62,12 45.37,13.75 48.22,13.75 v54.89,6.92
N$12
  Top 0.203: LED7.4-DIN 25.2,5.18 34.25,5.18 36.54,7.47 LED6.2-DOUT
N$13
  Top 0.203: LED7.2-DOUT 16.4,11.91 11.3,17.02 LED8.4-DIN
N$14
  Top 0.203: LED8.2-DOUT 8,26.03 6.85,27.18 LED9.4-DIN
N$15
  Top 0.203: LED9.2-DOUT 3.55,49.88 7.27,53.59 10.44,53.59 11.24,52.8 11.24,52.03 | 11.24,51.69 11.24,52.03 | 11.24,52.03 LED10.4-DIN
N$16
  Top 0.203: LED10.2-DOUT 8,58.45 15.52,65.98 21.55,65.98 LED11.4-DIN
N$17
  Top 0.203: LED11.2-DOUT 20.67,69.06 22.19,70.58 36.95,70.58 38.93,68.61 LED12.4-DIN
N$18
  Top 0.203: R12.2 55.84,54.23 56.32,54.71 56.32,64.1 LED1.4-DIN
NEO_DOUT
  Top 0.203: H1.1 34.73,67.25 35.52,66.45 41.56,66.45 43.62,68.52 43.62,73.6 42.51,74.71 37.77,74.71 LED12.2-DOUT
RD+
  Top 0.203: U2.11 46.73,18.1 R3.1
RD-
  Top 0.203: U2.12 47.38,18.25 47.91,17.72 50.29,17.72 50.92,17.08 R2.1
RESET  (via drill 0.36)
  Top 0.203: v30.6,44.07 29.49,45.18 29.17,45.18 28.7,44.7 R9.1 | C4.2 v44.1,37.56 | U1.29 32.89,50.33 32.19,49.63 v30.6,49.63
  Bottom 0.203: v30.6,49.63 30.6,57.4 32.83,59.63 H6.5
  Bottom 0.254: v30.6,49.63 v30.6,44.07 32.35,42.32 39.33,42.32 v44.1,37.56
RX_D0  (via drill 0.36)
  Top 0.203: U2.20 52.58,22.07 53.62,23.11 53.62,28.04 v48.54,33.12 | U1.30 32.9,49.54 32.19,48.83 v32.19,44.7
  Bottom 0.254: v32.19,44.7 39.18,44.7 48.54,35.34 v48.54,33.12
RXLED  (via drill 0.36)
  Top 0.203: U2.10 46.73,27.97 v47.11,28.35 | v49.97,37.4 R6.1
  Bottom 0.203: v47.11,28.35 49.97,31.21 v49.97,37.4
SCK_D13
  Top 0.203: 46.95,61.06 43.94,61.06 41.87,58.99 41.87,56.61 41.02,55.75 U1.17 | 46.95,61.06 H6.3 | R5.1 47.11,61.21 46.95,61.06
SCL_A5
  Top 0.203: U1.28 32.91,51.14 32.35,50.58 23.78,50.58 23.14,49.94 23.14,46.61 21.87,45.34 U3.8 19.01,45.34 18.7,45.02 18.7,42.8 18.38,42.48 R7.1 15.2,42.48 14.09,42.48 H5.4
SDA_A4
  Top 0.203: U1.27 32.91,51.93 32.03,51.05 23.3,51.05 22.67,50.42 22.67,47.24 22.03,46.61 U3.7 19.01,46.61 18.7,46.93 18.7,50.9 18.38,51.21 R8.1 17.11,51.21 H5.1
TX_D1  (via drill 0.36)
  Top 0.203: U2.4 50.63,27.54 v47.43,30.73 | U1.31 33.2,48.73 32.83,48.36 32.83,45.5 33.14,45.18 v33.14,43.12
  Bottom 0.254: v33.14,43.12 39.65,43.12 47.43,35.5 v47.43,30.73
TXLED  (via drill 0.36)
  Top 0.203: U2.17 50.63,20.91 v51.24,21.53 | v53.15,39.47 R4.1
  Bottom 0.203: v51.24,21.53 53.15,23.27 v53.15,39.47
VCCIO
  Top 0.203: U2.13 48.03,21.01 48.22,21.21 | U2.14 48.68,20.76 48.22,21.21 | 48.22,21.21 48.22,22.16 51.28,25.22 U2.3 51.28,28.16 47.75,31.69 46.11,31.69 C27.1
VCOIN  (via drill 0.36)
  Top 0.254: B2.3 v22.82,25.34 | U3.6 19.65,47.88 19.33,48.2 19.33,50.74 v19.65,51.05
  Bottom 0.203: B2.3 24.25,25.34
  Bottom 0.254: v22.82,25.34 24.25,25.34 25.52,26.29 25.52,45.18 v19.65,51.05
VUSB  (via drill 0.6)
  Top 0.203: C5.1 41.56,12.95 42.19,12.32 D4.A
  Top 0.406: J1.VBUS 44.73,8.67 44.41,10.1 44.3,10.42 | 44.3,10.42 43.78,11.84 | v45.53,11.84 45.53,11.64 44.3,10.42
  Top 0.762: 43.78,11.84 D4.A
  Bottom 0.406: J2.VBUS 47.59,8.19 47.59,8.99 48.22,9.62 48.22,11.37 47.75,11.84 v45.53,11.84
  pour Top (no thermals): 45.68,5.65 45.05,5.49 44.1,9.14 43.3,11.84 44.26,11.84 44.41,10.89 45.21,7.4
XTAL1
  Top 0.203: U1.7 40.23,45.71 40.92,45.02 43.46,45.02 43.62,44.87 R1.1 46,44.86 46.16,45.02 48.7,45.02 49.3,44.42 Y1.3 49.3,41.13 C2.1
XTAL2
  Top 0.203: U1.8 43.29,46.62 43.3,46.61 43.46,46.77 R1.2 46,46.77 46.05,46.82 Y1.1 47.15,48.92 C1.2

### Text on the board
tPlace: Dig13 | Neo=D9 | ext Neo pin | +5v | Signal | Gnd | SCK | Gnd | +5V | Rst | MISO | An0 | !SS | An1 | Gnd | MOSI | An2 | +5V | Lt Sens=An3 | I2C | Signal | +5V | Gnd | Dig6 | SCL | G | (+) | SDA | Dig5 | +5v | Gnd | CR1220 | Gnd | Gnd | Dig3 | Dig2 | Dig3 - Usr1 | Usr2 - Dig2 | Gnd | +
bPlace: to external | Neo=D9 | Neo pin | Light Sens=An3 | +5v | Gnd | Gnd | +5V | Signal | Rst | SCK | MISO | An0 | !SS_D10 | An1 | Gnd | MOSI | +5V | An2 | I2C | Signal | +5V | Gnd | Dig6 | SCL | G | (+) | SDA | Dig5 | +5v | Gnd | CR1220 | Gnd | Gnd | Dig2 | Dig3 | UnoNeoClock | V1.2, 2017 | by Duane Benson | Use "UNO" setting
tDocu: No tabs here